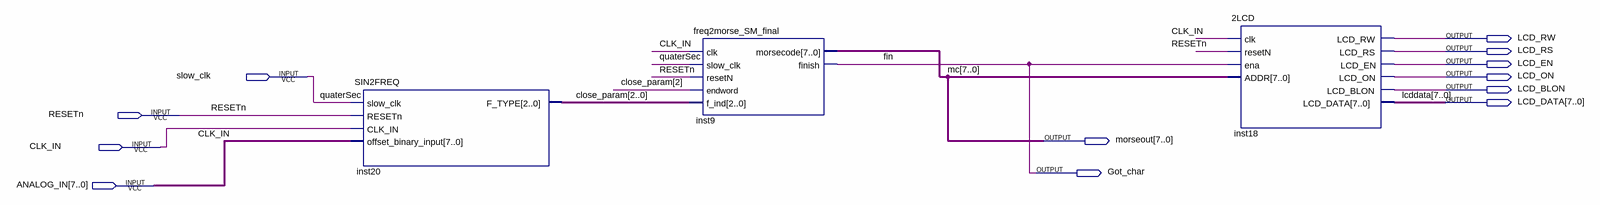
[diagram p0: schematic sheet]
// Quartus schematic Reciever.bdf as structural Verilog: 3 symbols, 12 pins
module Reciever (
  input  slow_clk,
  input  RESETn,
  input  CLK_IN,
  input  [7:0] ANALOG_IN,
  output LCD_RW,
  output LCD_RS,
  output LCD_EN,
  output LCD_ON,
  output LCD_BLON,
  output [7:0] LCD_DATA,
  output [7:0] morseout,
  output Got_char
);

  wire [2:0] close_param;

  SIN2FREQ inst20 (
    .slow_clk(slow_clk), .RESETn(RESETn), .CLK_IN(CLK_IN), .offset_binary_input(ANALOG_IN),
    .F_TYPE(close_param));
  freq2morse_SM_final inst9 (
    .clk(CLK_IN), .slow_clk(slow_clk), .resetN(RESETn), .endword(close_param[2]), .f_ind(close_param),
    .morsecode(morseout), .finish(Got_char));
  \2LCD  inst18 (
    .clk(CLK_IN), .resetN(RESETn), .ena(Got_char), .ADDR(morseout), .LCD_RW(LCD_RW), .LCD_RS(LCD_RS),
    .LCD_EN(LCD_EN), .LCD_ON(LCD_ON), .LCD_BLON(LCD_BLON), .LCD_DATA(LCD_DATA));

  // Other names for the same wires on the sheet: fin = Got_char; lcddata[7:0] = LCD_DATA; mc[7:0] = morseout;
  //   quaterSec = slow_clk
endmodule
